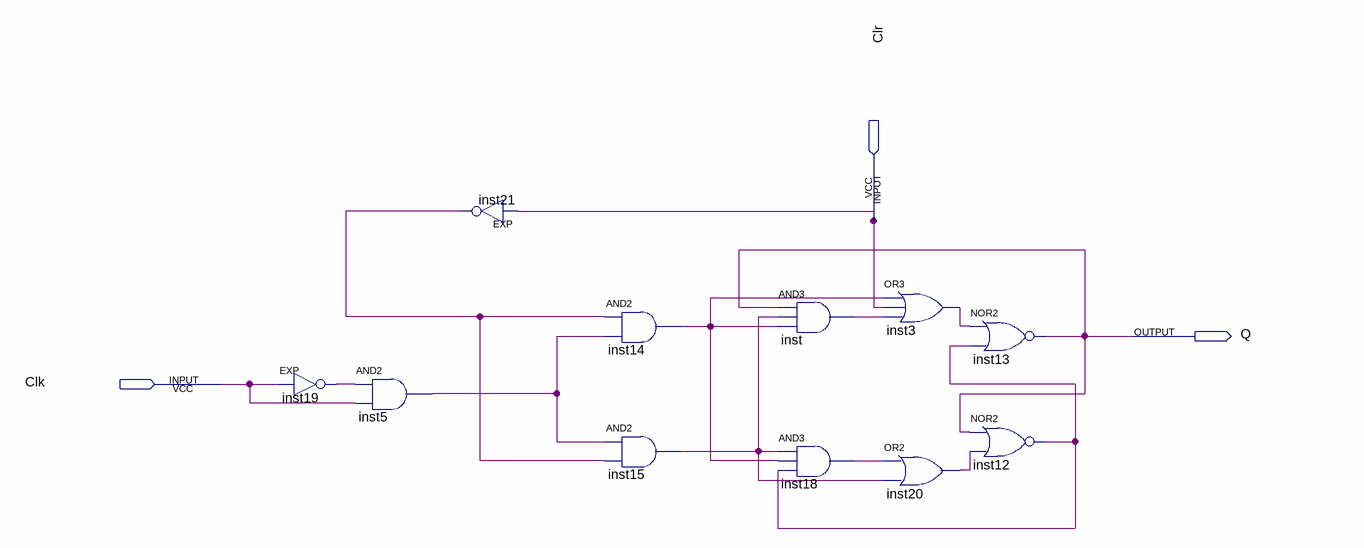
[diagram p0: schematic sheet]
// Quartus schematic FlipFlop-JK.bdf as structural Verilog: 11 symbols, 3 pins
module \FlipFlop-JK  (
  input  Clr,
  input  Clk,
  output Q
);

  wire inst3_out, inst5_out, inst12_out, inst14_out, inst15_out, inst18_out, inst19_out, inst20_out,
       inst21_out, inst_out;

  EXP inst19 (.IN(Clk), .OUT(inst19_out));
  and inst5 (inst5_out, inst19_out, Clk);
  EXP inst21 (.IN(Clr), .OUT(inst21_out));
  and inst14 (inst14_out, inst21_out, inst5_out);
  and inst15 (inst15_out, inst5_out, inst21_out);
  and inst (inst_out, Q, inst15_out, inst14_out);
  and inst18 (inst18_out, inst15_out, inst14_out, inst12_out);
  or inst3 (inst3_out, inst14_out, Clr, inst_out);
  or inst20 (inst20_out, inst18_out, inst15_out);
  nor inst13 (Q, inst3_out, inst12_out);
  nor inst12 (inst12_out, Q, inst20_out);
endmodule
